# Altium schematic sheet 06_Analog_and_Motor.SchDoc
size A; SheetNumber: 6; SheetTotal: 9
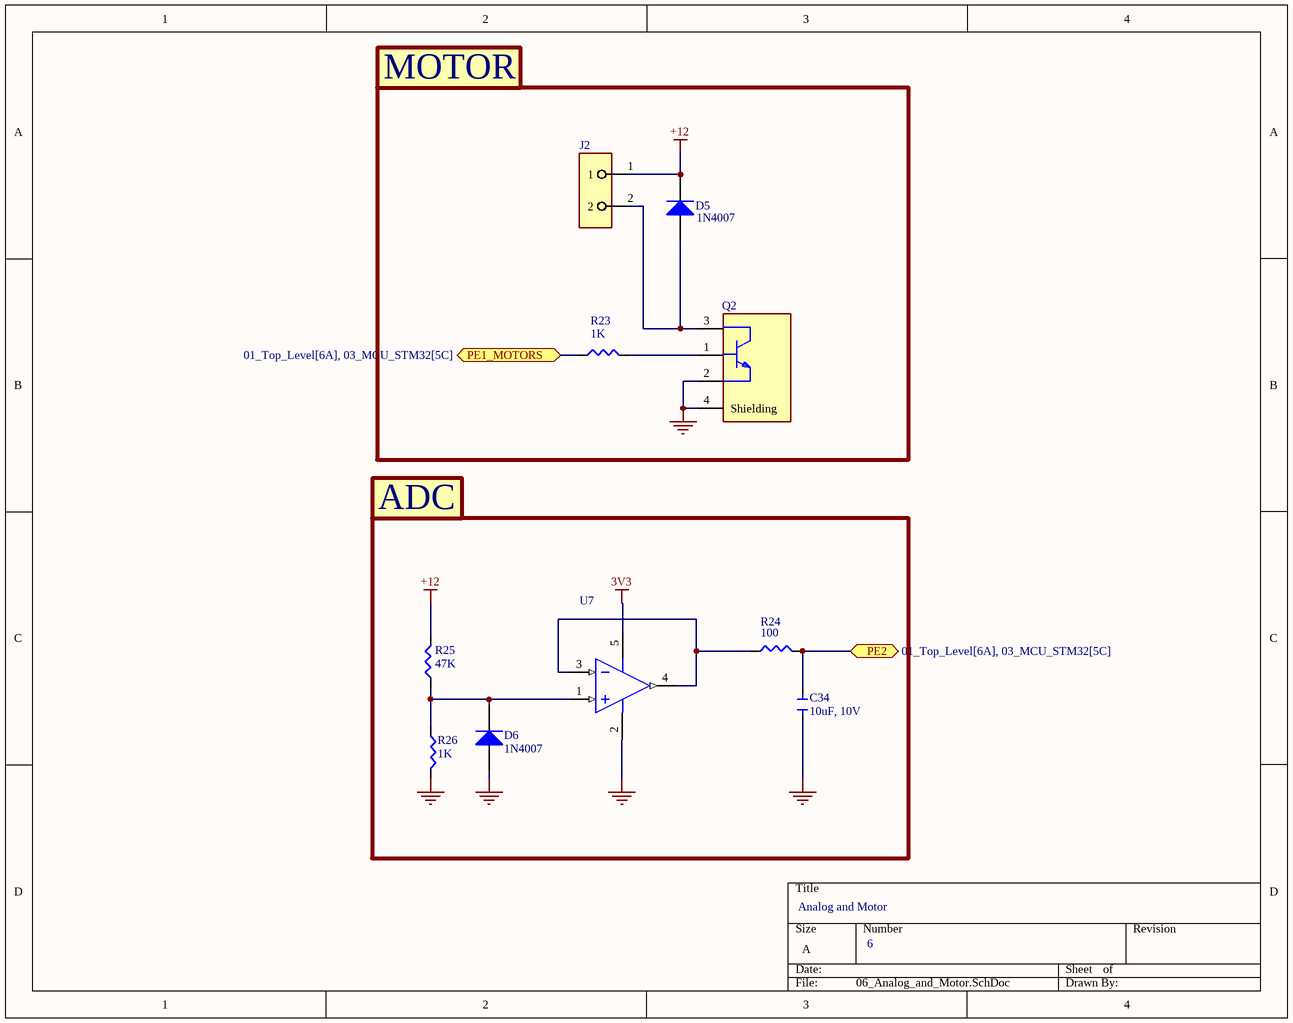
[diagram p0: 06_Analog_and_Motor.SchDoc]

## Parts
C34  10uF, 10V  [CAP_10uF]
D5  1N4007  [FAIR-DO-41-2]
D6  1N4007  [FAIR-DO-41-2]
J2  43640-0201  [FP-43640-0201-MFG]  (value not drawn)
Q2  JANTX2N2222AUB/TR  [FP-UB-IPC_A]  (value not drawn)
R23  1K  [RES_2K]
R24  100  [RES_2K]
R25  47K  [RES_2K]
R26  1K  [RES_2K]
U7  LMV321SN3T1G  [ONSC-TSOP-5-483-02_V]  (value not drawn)

## Blocks framed on the sheet
MOTOR: D5 J2 Q2 R23
ADC: C34 D6 R24-R26 U7

## Ports
PE1_MOTORS (bidir, see 01_Top_Level[6A], 03_MCU_STM32[5C]), PE2 (bidir, see 01_Top_Level[6A], 03_MCU_STM32[5C])

## Nets
3V3: U7.5(V+)
+12: D5.1(K) J2.1 R25.2
GND: C34.1 D6.2(A) Q2.2(E) Q2.4(Shielding) R26.2 U7.2(V-)
PE1_MOTORS: R23.1 ; port PE1_MOTORS
PE2: C34.2 R24.2 ; port PE2
NetD5_2: D5.2(A) J2.2 Q2.3(C)
NetD6_1: D6.1(K) R25.1 R26.1 U7.1(IN+)
NetQ2_1: Q2.1(B) R23.2
NetR24_1: R24.1 U7.3(IN-) U7.4(OUT)

## Notes on the sheet
- Analog and Motor
- 6

## Library data of the parts
C34 = CAP_0402_10UF: CAP CER 10UF 10V X5R 0402; Manufacturer: Samsung Electro-Mechanics; Manufacturer Part Number: C307415; Dielectric Material: Ceramic; Multilayer: Yes; Tolerance  (fill in as +-): 20%; Supplier: LCSC; Supplier Part Number: 1276-6830-1-ND; RoHS: Yes; Category: Ceramic Capacitors; Stock: 1294909; Pricing: 1=0.33, 10=0.215, 50=0.1584, 100=0.129, 500=0.1018, 1000=0.08597, 2500=0.08145 (USD); Mounting Technology: Surface Mount; Pins: 2; Package Shape: Rectangular; Case/Package: 0402; Terminal Finish: Nickel; Min Operating Temperature: -55°C; Max Operating Temperature: 85°C; JESD-609 Code: e3; Value: 10uF; Capacitor Type: Ceramic; Packaging: Tape and Reel; Tolerance (fill in as +-): 20%; Rated DC Voltage (URdc): 10V; Temperature Characteristics Code: X5R; Termination: Wraparound; Reach SVHC Compliant: Yes; RoHS Compliant: Yes; ComponentLink1URL: https://datasheet.ciiva.com:443/pdfs/VipMasterIC/IC/SEMS/SEMS-S-A0008521219/SEMS-S-A0008521325-1.pdf?src-supplier=IHS+Markit; ComponentLink1Description: https://datasheet.ciiva.com:443/pdfs/VipMasterIC/IC/SEMS/SEMS-S-A0008521219/SEMS-S-A0008521325-1.pdf?src-supplier=IHS+Markit; ComponentLink2URL: http://www.samsungsem.com/kr/support/product-search/mlcc/CL05A106MP8NUB8.jsp?src-supplier=Digikey; ComponentLink2Description: http://www.samsungsem.com/kr/support/product-search/mlcc/CL05A106MP8NUB8.jsp?src-supplier=Digikey; ComponentLink3URL: https://datasheet.octopart.com/CL05A106MP8NUB8-Samsung-Electro-Mechanics-datasheet-136460857.pdf?src-supplier=Future+Electronics; ComponentLink3Description: https://datasheet.octopart.com/CL05A106MP8NUB8-Samsung-Electro-Mechanics-datasheet-136460857.pdf?src-supplier=Future+Electronics; LCSC Part Number: C307415
D5 D6 = CMP-004-00007-2: General Purpose Rectifier, 1.1 V, 1.0 A, -55 to 175 degC, 2-Pin DO-41, RoHS, Tape and Reel; Manufacturer: Fairchild; Peak Reverse Current: 5uA; Max Surge Current: 30A; Elements: 1; Forward Voltage: 1.1V; Package Version: Rev. 2, 09/2008; Forward Current: 1A; Package Quantity: 5000; Packaging: TapeandReel; Package URL: http://www.fairchildsemi.com/dwg/DO/DO41A.pdf; Manufacturer URL: https://www.fairchildsemi.com/; Package Reference: DO-41-2; Pins: 2; Min Operating Temperature: -55°C; Datasheet Version: Rev. 1.1.0, 11/2014; Max Operating Temperature: 175°C; RoHS Compliant: True; Case/Package: DO-41-2; Mounting Technology: TH; Package Description: 2-Pin Axial Lead, Dia 2.375 mm, Body Length 4.63 mm; Datasheet URL: https://www.fairchildsemi.com/datasheets/1N/1N4007.pdf
J2 = CMP-04776-000134-1: CONN PLUG 2POS 3MM SINGLE ROW; Glow Wire Compliant: Non-compliant; Gender: Male; Number of Contacts: 2; Max Voltage Rating (DC): 250.25kV; Connector Type: Power; Approvals: UL; Working Voltage: 250V; Current Rating: 5A; Contact Resistance: 10mR; Body Material: Polyester; Max Operating Temperature: 105°C; Radiation Hardening: No; Min Operating Temperature: -40°C; Housing Color: Black; Lead Free: Lead Free; Contact Plating: Nickel; Pitch: 3mm; Packaging: Bulk; Voltage Rating (AC): 250V; Number of Rows: 1; Depth: 24.53mm; Mount: Cable; Package Quantity: 2500; Material: Polyester; Flammability Rating: UL94 V-0; Orientation: Straight; Operating Supply Voltage: 250V; Case/Package: 0201; Number of Poles: 2; Series: 43640; Housing Material: Polyester; Contact Gender: Male; Contact Material: Bronze; Termination: Crimp; Length: 6.85mm; Height: 3.86mm; Color: Black; Number of Positions: 2
Q2 = CMP-00252-101463705-1: JANTX2N2222AUB/TR Trans Gp Bjt NPN 50V 0.8A 3-PIN Ub T/r; hFE Min: 100; Collector Emitter Saturation Voltage: 300mV; Max Collector Current: 800mA; Max Junction Temperature (Tj): 200°C; Number of Elements: 1; Power Dissipation: 500mW; Collector Base Voltage (VCBO): 75V; Emitter Base Voltage (VEBO): 6V; Mount: Surface Mount; Polarity: NPN; Max Operating Temperature: 200°C; Number of Pins: 3; NexarPartId: 101463705; Height: 1.8mm; Schedule B: 8541290040; Radiation Hardening: No; Collector Emitter Voltage (VCEO): 50V; Min Operating Temperature: -65°C; Collector Emitter Breakdown Voltage: 50V; RoHS: Non-Compliant; Max Power Dissipation: 500mW
R23-R26 = RSE_0603_2K: 100mW 2KΩ 75V Thick Film Resistor ±100ppm/℃ ±1% 0603 Chip Resistor - Surface Mount RoHS; ComponentLink1Description: datasheet; ComponentLink1URL: https://www.lcsc.com/product-detail/C105588.html?s_z=n_resistance%2520100%2520ohm
U7 = CMP-1310-00382-1: Single Low-Voltage, Rail-to-Rail Operational Amplifier, 2.7 to 5.5 V, -40 to 85 degC, 5-Pin TSOP, Pb-Free, Tape and Reel; Manufacturer: On Semiconductor; SR Typ (V/uS): 1; VCC Min (V): 2.7; VCC Max (V): 5.5; DatasheetVersion: Rev. 10; ComponentLink3Description: Package Specification; PackageDescription: 5-Pin Small Outline Package, Body 3 x 1.5 mm, Pitch 0.95 mm; ComponentLink1Description: Manufacturer URL; ComponentLink2URL: http://www.onsemi.cn/pub_link/Collateral/LMV321-LMV358-LMV324-D.PDF; GBW Typ (MHz): 1; ComponentLink3URL: http://www.onsemi.com/pub_link/Collateral/483.PDF; RoHS: TRUE; Packing: Tape and Reel; ComponentLink2Description: Datasheet; PackageReference: TSOP-5-483-02; ComponentLink1URL: http://www.onsemi.com/; PackageVersion: Rev. K, 04/2013; Mounting Technology: Surface Mount; PartNumber: LMV321SN3T1G